# Altium project PCB_Project.PrjPcb (part 2 of 2)

## Sheet ADCwHarness.SchDoc: ADC with Harness
size A; Author: Max Bakes; CompanyName: BYUI; DrawnBy: Max Bakes; Engineer: Max Bakes; Organization: CSEE; DocumentNumber: 1; Revision: 0.0.1; SheetNumber: 1; SheetTotal: 15
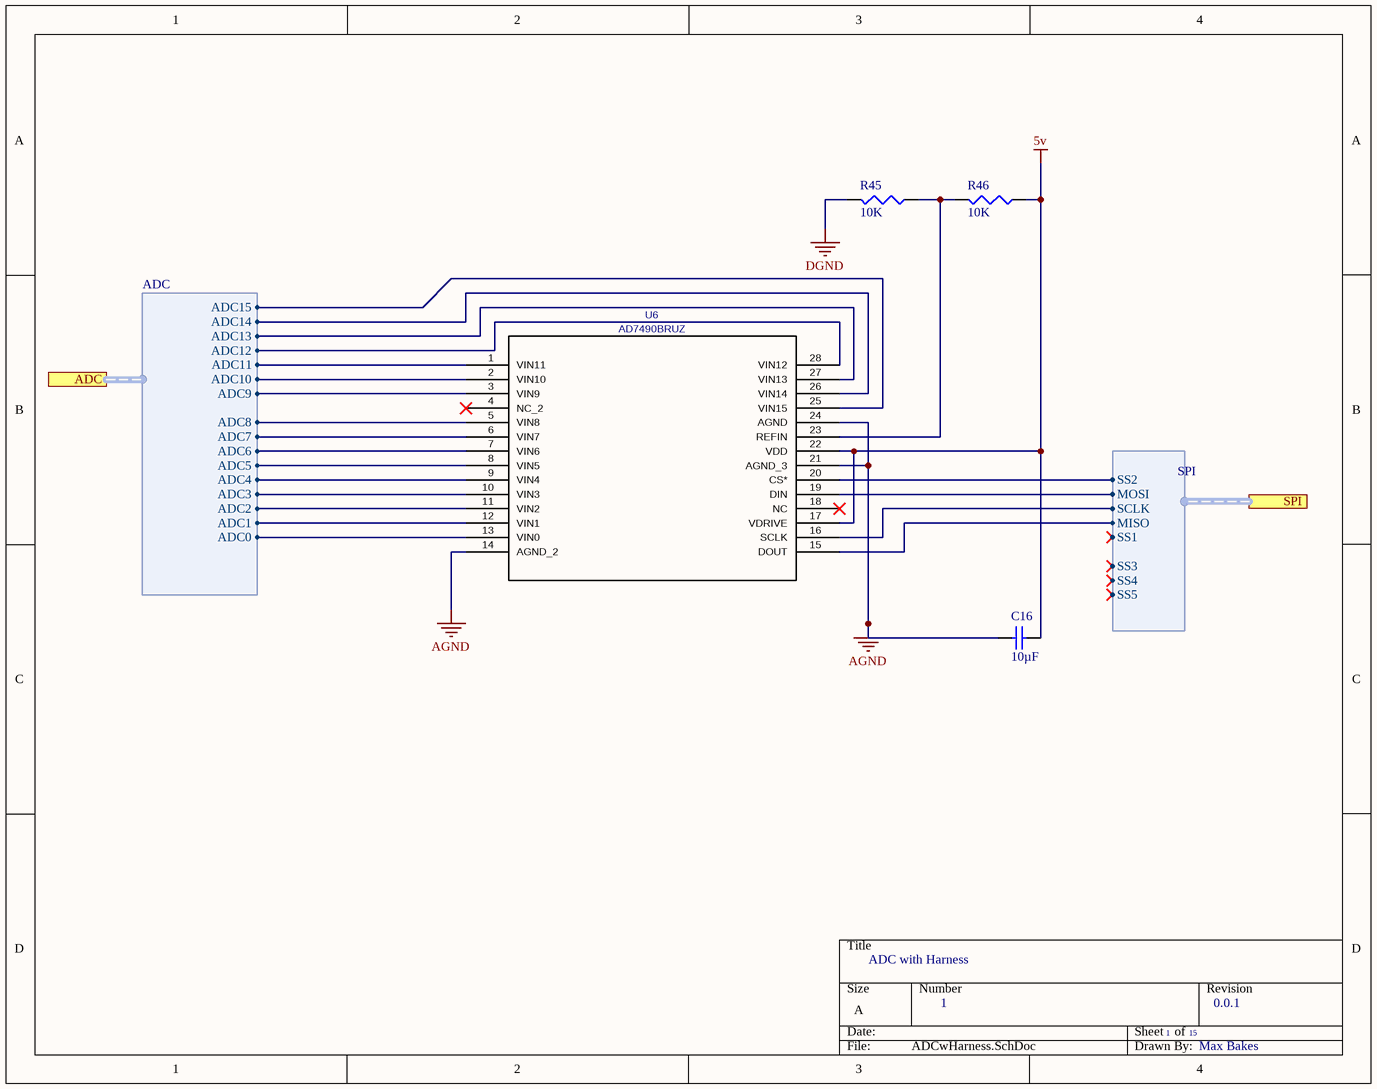
[diagram p13: ADCwHarness.SchDoc]

### Parts
C16  Capacitance: 10µF  [CAPC1608X90X20LL10]  (hidden comment: C1608X5R1A106K080AC)
R45  value 10K  [J1-0603]  (hidden comment: Res3)
R46  value 10K  [J1-0603]  (hidden comment: Res3)
U6  AD7490BRUZ  [*SOP65P640X120-28N]

### Ports
ADC (harness ADC), SPI (harness SPI)

### Harnesses
ADC: ADC15, ADC14, ADC13, ADC12, ADC11, ADC10, ADC9, ADC8, ADC7, ADC6, ADC5, ADC4, ADC3, ADC2, ADC1, ADC0
SPI: SCLK, MOSI, MISO, SS5, SS2, SS3, SS1, SS4

### Nets
5v: C16.2 R46.1 U6.17(VDRIVE) U6.22(VDD)
AGND: C16.1 U6.14(AGND_2) U6.21(AGND_3) U6.24(AGND)
DGND: R45.2
NetJ1_D8: U6.16(SCLK) ; port SPI.SCLK
NetJ1_D9: U6.19(DIN) ; port SPI.MOSI
NetJ1_D11: U6.15(DOUT) ; port SPI.MISO
NetJ1_D14: U6.20(CS*) ; port SPI.SS2
NetJ7_2: U6.13(VIN0) ; port ADC.ADC0
NetJ7_4: U6.12(VIN1) ; port ADC.ADC1
NetJ7_6: U6.11(VIN2) ; port ADC.ADC2
NetJ7_8: U6.10(VIN3) ; port ADC.ADC3
NetJ7_10: U6.9(VIN4) ; port ADC.ADC4
NetJ7_12: U6.8(VIN5) ; port ADC.ADC5
NetJ7_14: U6.7(VIN6) ; port ADC.ADC6
NetJ7_16: U6.6(VIN7) ; port ADC.ADC7
NetJ7_18: U6.5(VIN8) ; port ADC.ADC8
NetJ7_20: U6.3(VIN9) ; port ADC.ADC9
NetJ7_22: U6.2(VIN10) ; port ADC.ADC10
NetJ7_24: U6.1(VIN11) ; port ADC.ADC11
NetJ7_26: U6.28(VIN12) ; port ADC.ADC12
NetJ7_28: U6.27(VIN13) ; port ADC.ADC13
NetJ7_30: U6.26(VIN14) ; port ADC.ADC14
NetJ7_32: U6.25(VIN15) ; port ADC.ADC15
NetR45_1: R45.1 R46.2 U6.23(REFIN)

Not connected (* = marked no-connect by the designer): U6 4(NC_2)* 18(NC)*

### Library data of the parts
C16 = CMP-2000-04979-1: Chip Capacitor, 10 uF, +/- 10%, 10 V, -55 to 85 degC, 0603 (1608 Metric), RoHS, Tape and Reel; PCN Part Number: MLCCPartNumberChange30/Nov/2012; Manufacturer: TDK; Temperature Coefficient: X5R; Product Training Modules: CSeriesGeneralApplicationsSEAT,CCV,andTVCLDesignToolsGuidetoReplacinganElectrolyticCapacitorwithanMLCC; Online Catalog: CSeries,GeneralPurpose; Voltage - Rated: 10V; Other Names: 445-7486-1; Design Resources: 20WNon-IsolatedBuckLEDDriverUsingPLLNK460KG; Kits: 445-9003-KIT-ND-KITCAPCERHICAPMLCCSMD; Height - Seated (Max): -; Family: CeramicCapacitors; Package Description: 2-Pin Surface Mount Device, Body 1.6 x 0.8 mm; Category: Capacitors; Datasheet Version: Mar-15; RoHS Information: RoHSCertificate-MLCC; Thickness (Max): 0.035"(0.90mm); Operating Temperature: -55degC~85degC; Package Reference: 603; Series: C; Applications: GeneralPurpose; Datasheet URL: http://download.siliconexpert.com/pdfs/2015/4/21/15/54/45/779/tdk_/manual/37024850441143360mlcc_commercial_general_en.pdf; Features: -; Lead Style: -; Lead Spacing: -; Ratings: -; Size / Dimension: 0.063"Lx0.031"W(1.60mmx0.80mm); Tolerance: ±10%; Mounting Type: SurfaceMount,MLCC; Standard Package: 1; Package / Case: 0603(1608Metric); Manufacturer URL: http://www.tdk.com/; Packaging: CutTape(CT); Manufacturer Part Number: C1608X5R1A106K080AC
R45 R46 = Res3: Resistor; Published: 8-Jun-2000; LatestRevisionDate: 29-May-2009; LatestRevisionNote: IPC-7351 Footprint Added.; PackageReference: J1-0603; Publisher: Altium Limited; PackageDescription: Chip Resistor
U6 = AD7490BRUZ: 16-Channel, 1 MSPS, 12-Bit ADC / with Sequencer in 28-Lead TSSOP; C: Copyright (C) 2015 Accelerated Designs. All rights reserved; Vendor: Analog Devices Inc; Built_By: EMA_UL_Team; Value: AD7490BRUZ; Manufacturer_Part_Number: AD7490BRUZ

## Sheet Accelerometer.SchDoc: Accelerometer
size A; Author: Zac Carico; CompanyName: BYUI; DrawnBy: Zac Carico; Engineer: Zac Carico; Organization: CSEE; DocumentNumber: 12; Revision: 0.0.1; SheetNumber: 12; SheetTotal: 15
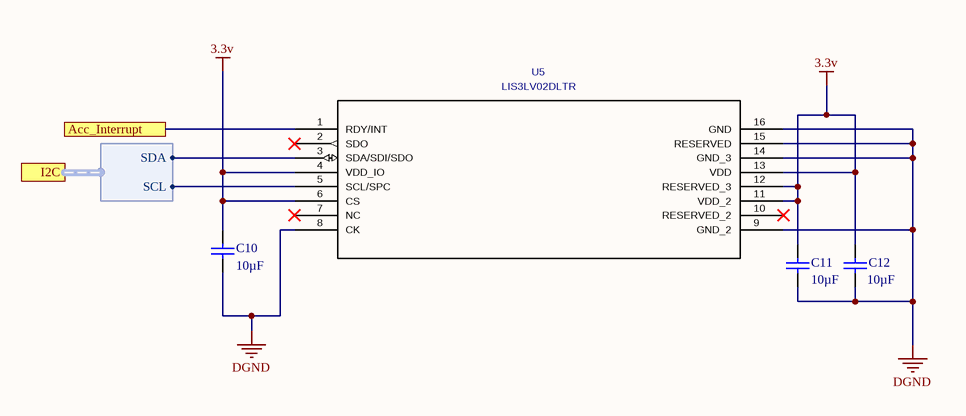
[diagram p14: Accelerometer.SchDoc]

### Parts
C10  Capacitance: 10µF  [CAPC1608X90X20LL10]  (hidden comment: C1608X5R1A106K080AC)
C11  Capacitance: 10µF  [CAPC1608X90X20LL10]  (hidden comment: C1608X5R1A106K080AC)
C12  Capacitance: 10µF  [CAPC1608X90X20LL10]  (hidden comment: C1608X5R1A106K080AC)
U5  LIS3LV02DLTR  [LGA-16_4P4X7P5X1]

### Ports
Acc_Interrupt, I2C (harness I2C)

### Harnesses
I2C: SCL, SDA

### Nets
3.3v: C10.2 C11.2 C12.2 U5.4(VDD_IO) U5.6(CS) U5.11(VDD_2) U5.12(RESERVED_3) U5.13(VDD)
DGND: C10.1 C11.1 C12.1 U5.8(CK) U5.9(GND_2) U5.14(GND_3) U5.15(RESERVED) U5.16(GND)
NetJ1_C26: U5.5(SCL/SPC) ; port I2C.SCL
NetJ1_C27: U5.3(SDA/SDI/SDO) ; port I2C.SDA
NetJ1_F19: U5.1(RDY/INT) ; port Acc_Interrupt

Not connected (* = marked no-connect by the designer): U5 2(SDO)* 7(NC)* 10(RESERVED_2)*

### Library data of the parts
C10-C12 = CMP-2000-04979-1: as C16 on sheet ADCwHarness; Height - Seated (Max): -; Family: CeramicCapacitors; Package Description: 2-Pin Surface Mount Device, Body 1.6 x 0.8 mm; Category: Capacitors; Datasheet Version: Mar-15; RoHS Information: RoHSCertificate-MLCC; Thickness (Max): 0.035"(0.90mm); Operating Temperature: -55degC~85degC; Package Reference: 603; Series: C; Applications: GeneralPurpose; Datasheet URL: http://download.siliconexpert.com/pdfs/2015/4/21/15/54/45/779/tdk_/manual/37024850441143360mlcc_commercial_general_en.pdf; Features: -; Lead Style: -; Lead Spacing: -; Ratings: -; Size / Dimension: 0.063"Lx0.031"W(1.60mmx0.80mm); Tolerance: ±10%; Mounting Type: SurfaceMount,MLCC; Standard Package: 1; Package / Case: 0603(1608Metric); Manufacturer URL: http://www.tdk.com/; Packaging: CutTape(CT); Manufacturer Part Number: C1608X5R1A106K080AC
U5 = LIS3LV02DLTR: ACCELEROMETER 2-6G I2C/SPI 16LGA; C: Copyright (C) 2015 Accelerated Designs. All rights reserved; Vendor: STMicroelectronics; Built_By: EMA_UL_Team; Value: LIS3LV02DLTR; Manufacturer_Part_Number: LIS3LV02DLTR

## Nets that join several sheets
3.3v: FMC_connector_CD (P1.2), LVDS_UART (10 pins), Ext_connections (6 pins), GPIO_SW (10 pins), GPIO_LED (10 pins), I2C_sensors (14 pins), LCD_Screen (C13.2 J2.7 J2.A J8.2), Accelerometer (8 pins)
5v: FMC_top (C17.2 R18.2 U17.2), ADCwHarness (C16.2 R46.1 U6.17 U6.22)
12v: FMC_top (C18.2 U17.3), FMC_connector_CD (J1.C35 J1.C37 R17.1)
AGND: top (W2.2), Ext_connections (16 pins), ADCwHarness (C16.1 U6.14 U6.21 U6.24)
DGND: top (W1.2 W2.1), FMC_top (C17.1 C18.1 P5.2 U17.1), FMC_connector_AB (39 pins), FMC_connector_CD (23 pins), FMC_connector_EF (19 pins), LVDS_UART (11 pins), Ext_connections (S11.3), GPIO_SW (10 pins), GPIO_LED (10 pins), I2C_sensors (13 pins), LCD_Screen (6 pins), ADCwHarness (R45.2), Accelerometer (8 pins)
PGND: top (W1.1), I2C_sensors (C5.1 C6.1 U2.4)
NetJ1_A2: FMC_connector_AB (J1.A2), LVDS_UART (J3.1 R7.1)
NetJ1_A3: FMC_connector_AB (J1.A3), LVDS_UART (J3.2)
NetJ1_A6: FMC_connector_AB (J1.A6), LVDS_UART (J3.6 R6.1)
NetJ1_A7: FMC_connector_AB (J1.A7), LVDS_UART (J3.7)
NetJ1_A10: FMC_connector_AB (J1.A10), LVDS_UART (J3.11 R5.1)
NetJ1_A11: FMC_connector_AB (J1.A11), LVDS_UART (J3.12)
NetJ1_A14: FMC_connector_AB (J1.A14), LVDS_UART (J5.1 R8.1)
NetJ1_A15: FMC_connector_AB (J1.A15), LVDS_UART (J5.2)
NetJ1_A18: FMC_connector_AB (J1.A18), LVDS_UART (J5.6 R10.1)
NetJ1_A19: FMC_connector_AB (J1.A19), LVDS_UART (J5.7)
NetJ1_A22: FMC_connector_AB (J1.A22), LVDS_UART (J3.3)
NetJ1_A23: FMC_connector_AB (J1.A23), LVDS_UART (J3.4)
NetJ1_A26: FMC_connector_AB (J1.A26), LVDS_UART (J3.8)
NetJ1_A27: FMC_connector_AB (J1.A27), LVDS_UART (J3.9)
NetJ1_A30: FMC_connector_AB (J1.A30), LVDS_UART (J3.13)
NetJ1_A31: FMC_connector_AB (J1.A31), LVDS_UART (J3.14)
NetJ1_A34: FMC_connector_AB (J1.A34), LVDS_UART (J5.3)
NetJ1_A35: FMC_connector_AB (J1.A35), LVDS_UART (J5.4)
NetJ1_A38: FMC_connector_AB (J1.A38), LVDS_UART (J5.8)
NetJ1_A39: FMC_connector_AB (J1.A39), LVDS_UART (J5.9)
NetJ1_B12: FMC_connector_AB (J1.B12), LVDS_UART (J6.1 R11.1)
NetJ1_B13: FMC_connector_AB (J1.B13), LVDS_UART (J6.2)
NetJ1_B16: FMC_connector_AB (J1.B16), LVDS_UART (J6.6 R12.1)
NetJ1_B17: FMC_connector_AB (J1.B17), LVDS_UART (J6.7)
NetJ1_B32: FMC_connector_AB (J1.B32), LVDS_UART (J6.3)
NetJ1_B33: FMC_connector_AB (J1.B33), LVDS_UART (J6.4)
NetJ1_B36: FMC_connector_AB (J1.B36), LVDS_UART (J6.8)
NetJ1_B37: FMC_connector_AB (J1.B37), LVDS_UART (J6.9)
NetJ1_C2: FMC_connector_CD (J1.C2), LVDS_UART (J4.3)
NetJ1_C3: FMC_connector_CD (J1.C3), LVDS_UART (J4.4)
NetJ1_C6: FMC_connector_CD (J1.C6), LVDS_UART (J4.1 R13.1)
NetJ1_C7: FMC_connector_CD (J1.C7), LVDS_UART (J4.2)
NetJ1_C10: FMC_connector_CD (J1.C10), LVDS_UART (J4.6 R14.1)
NetJ1_C11: FMC_connector_CD (J1.C11), LVDS_UART (J4.7)
NetJ1_C14: FMC_connector_CD (J1.C14), LVDS_UART (J4.11 R15.1)
NetJ1_C15: FMC_connector_CD (J1.C15), LVDS_UART (J4.12)
NetJ1_C18: FMC_connector_CD (J1.C18), LVDS_UART (J4.8)
NetJ1_C19: FMC_connector_CD (J1.C19), LVDS_UART (J4.9)
NetJ1_C22: FMC_connector_CD (J1.C22), LVDS_UART (J4.13)
NetJ1_C23: FMC_connector_CD (J1.C23), LVDS_UART (J4.14)
NetJ1_C26: FMC_connector_CD (J1.C26), Ext_connections (P6.2 P8.2 R22.1), I2C_sensors (U1.4 U3.6), Accelerometer (U5.5)
NetJ1_C27: FMC_connector_CD (J1.C27), Ext_connections (P6.1 P8.1 R23.1), I2C_sensors (U1.3 U3.5), Accelerometer (U5.3)
NetJ1_D8: FMC_connector_CD (J1.D8), Ext_connections (P4.1), LCD_Screen (J2.4), ADCwHarness (U6.16)
NetJ1_D9: FMC_connector_CD (J1.D9), Ext_connections (P4.2), ADCwHarness (U6.19)
NetJ1_D11: FMC_connector_CD (J1.D11), Ext_connections (P4.3), LCD_Screen (J2.5), ADCwHarness (U6.15)
NetJ1_D12: FMC_connector_CD (J1.D12), LCD_Screen (J2.3)
NetJ1_D14: FMC_connector_CD (J1.D14), ADCwHarness (U6.20)
NetJ1_D18: FMC_connector_CD (J1.D18), Ext_connections (P4.4)
NetJ1_D20: FMC_connector_CD (J1.D20), Ext_connections (P9.1 R19.1)
NetJ1_D21: FMC_connector_CD (J1.D21), Ext_connections (P9.2)
NetJ1_D23: FMC_connector_CD (J1.D23), Ext_connections (P9.3 R20.1)
NetJ1_D24: FMC_connector_CD (J1.D24), Ext_connections (P9.4)
NetJ1_D26: FMC_connector_CD (J1.D26), Ext_connections (P9.5 R21.1)
NetJ1_D27: FMC_connector_CD (J1.D27), Ext_connections (P9.6)
NetJ1_E2: FMC_connector_EF (J1.E2), LCD_Screen (J2.1)
NetJ1_E3: FMC_connector_EF (J1.E3), LCD_Screen (J2.2)
NetJ1_E6: FMC_connector_EF (J1.E6), Ext_connections (P7.1)
NetJ1_E7: FMC_connector_EF (J1.E7), Ext_connections (P7.2)
NetJ1_E9: FMC_connector_EF (J1.E9), Ext_connections (P7.3)
NetJ1_E10: FMC_connector_EF (J1.E10), Ext_connections (P7.4)
NetJ1_E12: FMC_connector_EF (J1.E12), Ext_connections (P7.5)
NetJ1_E13: FMC_connector_EF (J1.E13), Ext_connections (P7.6)
NetJ1_E15: FMC_connector_EF (J1.E15), Ext_connections (P7.7)
NetJ1_E16: FMC_connector_EF (J1.E16), Ext_connections (P7.8)
NetJ1_E18: FMC_connector_EF (J1.E18), Ext_connections (P7.9)
NetJ1_E19: FMC_connector_EF (J1.E19), Ext_connections (P7.10)
NetJ1_E21: FMC_connector_EF (J1.E21), GPIO_LED (R9.2)
NetJ1_E22: FMC_connector_EF (J1.E22), GPIO_LED (R50.2)
NetJ1_E24: FMC_connector_EF (J1.E24), GPIO_LED (R51.2)
NetJ1_E25: FMC_connector_EF (J1.E25), GPIO_LED (R52.2)
NetJ1_E27: FMC_connector_EF (J1.E27), GPIO_LED (R53.2)
NetJ1_E28: FMC_connector_EF (J1.E28), GPIO_LED (R54.2)
NetJ1_E30: FMC_connector_EF (J1.E30), GPIO_LED (R55.2)
NetJ1_E31: FMC_connector_EF (J1.E31), GPIO_LED (R56.2)
NetJ1_E33: FMC_connector_EF (J1.E33), GPIO_LED (R57.2)
NetJ1_E34: FMC_connector_EF (J1.E34), GPIO_LED (R58.2)
NetJ1_E36: FMC_connector_EF (J1.E36), LCD_Screen (J8.3 R47.2)
NetJ1_E37: FMC_connector_EF (J1.E37), LCD_Screen (J8.1 R48.2)
NetJ1_F4: FMC_connector_EF (J1.F4), GPIO_SW (R43.2 S10.S)
NetJ1_F5: FMC_connector_EF (J1.F5), GPIO_SW (R42.2 S9.S)
NetJ1_F7: FMC_connector_EF (J1.F7), GPIO_SW (R41.2 S8.S)
NetJ1_F8: FMC_connector_EF (J1.F8), GPIO_SW (R40.2 S7.S)
NetJ1_F10: FMC_connector_EF (J1.F10), GPIO_SW (R39.2 S6.S)
NetJ1_F11: FMC_connector_EF (J1.F11), GPIO_SW (R38.2 S5.S)
NetJ1_F13: FMC_connector_EF (J1.F13), GPIO_SW (R37.2 S4.S)
NetJ1_F14: FMC_connector_EF (J1.F14), GPIO_SW (R36.2 S3.S)
NetJ1_F16: FMC_connector_EF (J1.F16), GPIO_SW (R35.2 S2.S)
NetJ1_F17: FMC_connector_EF (J1.F17), GPIO_SW (R34.2 S1.S)
NetJ1_F19: FMC_connector_EF (J1.F19), Accelerometer (U5.1)
NetJ1_F20: FMC_connector_EF (J1.F20), Ext_connections (S11.2)
NetJ1_F37: FMC_connector_EF (J1.F37), I2C_sensors (R4.1 U2.13)
NetJ7_2: Ext_connections (J7.2), ADCwHarness (U6.13)
NetJ7_4: Ext_connections (J7.4), ADCwHarness (U6.12)
NetJ7_6: Ext_connections (J7.6), ADCwHarness (U6.11)
NetJ7_8: Ext_connections (J7.8), ADCwHarness (U6.10)
NetJ7_10: Ext_connections (J7.10), ADCwHarness (U6.9)
NetJ7_12: Ext_connections (J7.12), ADCwHarness (U6.8)
NetJ7_14: Ext_connections (J7.14), ADCwHarness (U6.7)
NetJ7_16: Ext_connections (J7.16), ADCwHarness (U6.6)
NetJ7_18: Ext_connections (J7.18), ADCwHarness (U6.5)
NetJ7_20: Ext_connections (J7.20), ADCwHarness (U6.3)
NetJ7_22: Ext_connections (J7.22), ADCwHarness (U6.2)
NetJ7_24: Ext_connections (J7.24), ADCwHarness (U6.1)
NetJ7_26: Ext_connections (J7.26), ADCwHarness (U6.28)
NetJ7_28: Ext_connections (J7.28), ADCwHarness (U6.27)
NetJ7_30: Ext_connections (J7.30), ADCwHarness (U6.26)
NetJ7_32: Ext_connections (J7.32), ADCwHarness (U6.25)